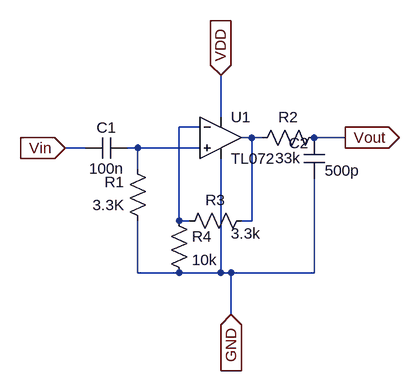
[diagram p0: schematic filtre_pass_band.asc]
filtre_pass_band.asc, the LTspice schematic file:
Version 4
SHEET 1 880 680
WIRE 256 160 256 96
WIRE 224 176 192 176
WIRE 304 192 288 192
WIRE 320 192 304 192
WIRE 448 192 400 192
WIRE 48 208 16 208
WIRE 128 208 112 208
WIRE 224 208 128 208
WIRE 128 240 128 208
WIRE 192 320 192 176
WIRE 208 320 192 320
WIRE 304 320 304 192
WIRE 304 320 288 320
WIRE 128 400 128 320
WIRE 192 400 128 400
WIRE 256 400 256 224
WIRE 256 400 192 400
WIRE 272 400 256 400
WIRE 400 400 400 256
WIRE 400 400 272 400
WIRE 272 464 272 400
FLAG 256 96 VDD
IOPIN 256 96 In
FLAG 448 192 Vout
IOPIN 448 192 Out
FLAG 16 208 Vin
IOPIN 16 208 In
FLAG 272 464 GND
IOPIN 272 464 In
SYMBOL res 144 336 R180
WINDOW 0 36 76 Left 2
WINDOW 3 36 40 Left 2
SYMATTR InstName R1
SYMATTR Value 3.3K
SYMBOL res 416 176 R90
WINDOW 0 0 56 VBottom 2
WINDOW 3 32 56 VTop 2
SYMATTR InstName R2
SYMATTR Value 33k
SYMBOL cap 112 192 R90
WINDOW 0 0 32 VBottom 2
WINDOW 3 32 32 VTop 2
SYMATTR InstName C1
SYMATTR Value 100n
SYMBOL cap 416 256 R180
WINDOW 0 24 56 Left 2
WINDOW 3 -54 13 Left 2
SYMATTR InstName C2
SYMATTR Value 500p
SYMBOL res 176 304 R0
SYMATTR InstName R4
SYMATTR Value 10k
SYMBOL TL072 256 128 R0
SYMATTR InstName U1
SYMBOL res 304 304 R90
WINDOW 0 0 56 VBottom 2
WINDOW 3 20 9 VTop 2
SYMATTR InstName R3
SYMATTR Value 3.3k

The netlist it stands for:
* filtre_pass_band.asc
R1 GND N003 3.3K
R2 Vout N002 33k
C1 N003 Vin 100n
C2 GND Vout 500p
R4 N001 GND 10k
* U1: TL072 (symbol TL072 not available, pins judged from their places): In+=N003 In-=N001 V+=VDD V-=GND OUT=N002
R3 N002 N001 3.3k
.backanno
.end